# Altium schematic sheet LIMIT_SENSORS.SchDoc
size 420 x 297 mm; SheetNumber: 27; SheetTotal: 27
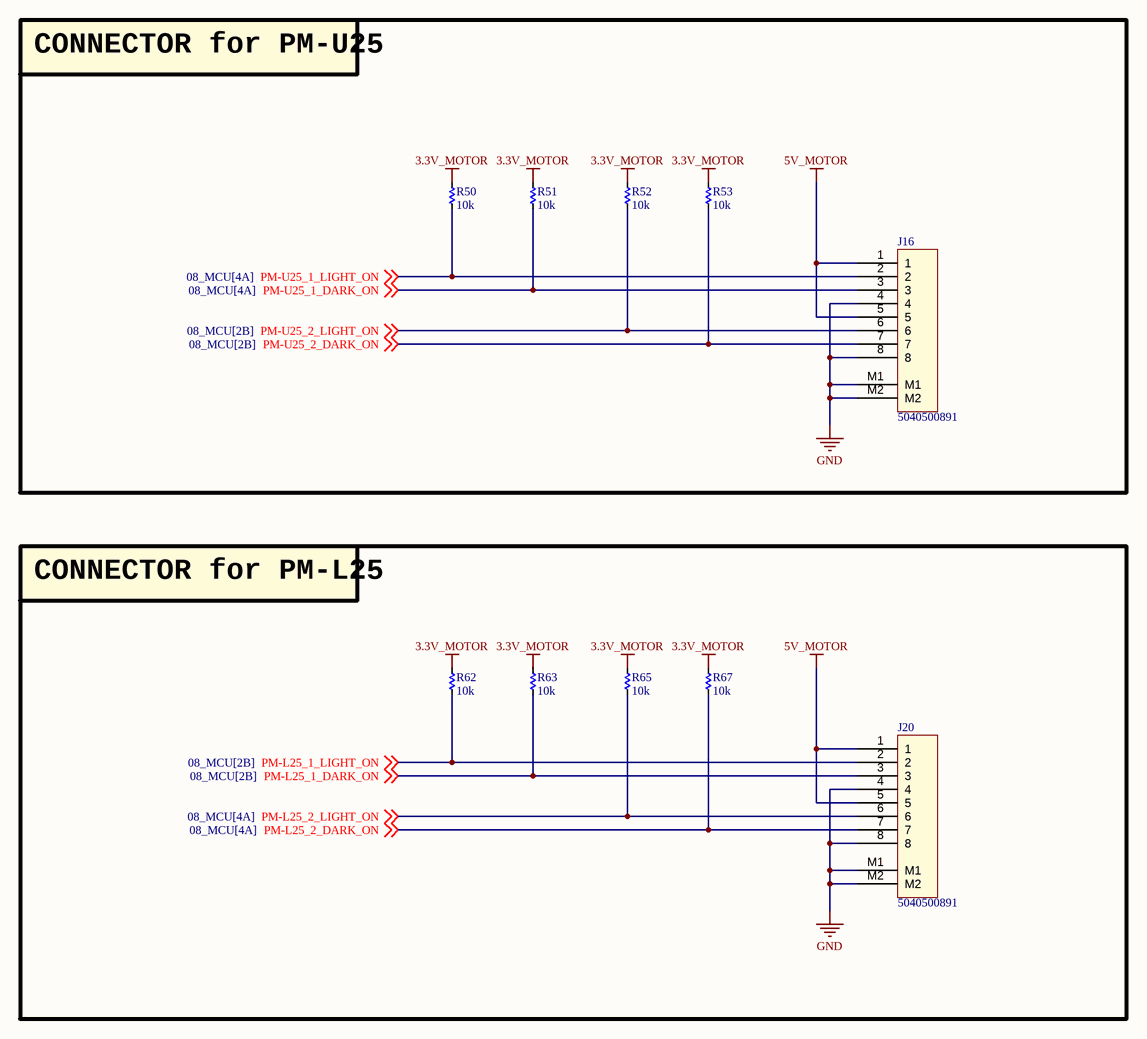
[diagram p0: LIMIT_SENSORS.SchDoc]

## Parts
J16  5040500891  [MOLEX_5040500891]
J20  5040500891  [MOLEX_5040500891]
R50  10k  [RES_C_1005X40]
R51  10k  [RES_C_1005X40]
R52  10k  [RES_C_1005X40]
R53  10k  [RES_C_1005X40]
R62  10k  [RES_C_1005X40]
R63  10k  [RES_C_1005X40]
R65  10k  [RES_C_1005X40]
R67  10k  [RES_C_1005X40]

## Blocks framed on the sheet
CONNECTOR for PM-U25: J16 R50-R53
CONNECTOR for PM-L25: J20 R62 R63 R65 R67

## Nets
3.3V_MOTOR: R50.2 R51.2 R52.2 R53.2 R62.2 R63.2 R65.2 R67.2
5V_MOTOR: J16.1 J16.5 J20.1 J20.5
GND: J16.4 J16.8 J16.M1 J16.M2 J20.4 J20.8 J20.M1 J20.M2
PM-L25_1_DARK_ON: J20.3 R63.1 ; off-sheet PM-L25_1_DARK_ON
PM-L25_1_LIGHT_ON: J20.2 R62.1 ; off-sheet PM-L25_1_LIGHT_ON
PM-L25_2_DARK_ON: J20.7 R67.1 ; off-sheet PM-L25_2_DARK_ON
PM-L25_2_LIGHT_ON: J20.6 R65.1 ; off-sheet PM-L25_2_LIGHT_ON
PM-U25_1_DARK_ON: J16.3 R51.1 ; off-sheet PM-U25_1_DARK_ON
PM-U25_1_LIGHT_ON: J16.2 R50.1 ; off-sheet PM-U25_1_LIGHT_ON
PM-U25_2_DARK_ON: J16.7 R53.1 ; off-sheet PM-U25_2_DARK_ON
PM-U25_2_LIGHT_ON: J16.6 R52.1 ; off-sheet PM-U25_2_LIGHT_ON

## Notes on the sheet
- Project
- Sub-system:
- Design by:
- Sheet title:
- Sheet:
- of
- Checked by:
- Approved by:
- Doc no:
- Revision
- Size:
- Date:

## Library data of the parts
J16 J20 = Header 8x1_2M
R50-R53 R62 R63 R65 R67 = _RES_B_2: RES